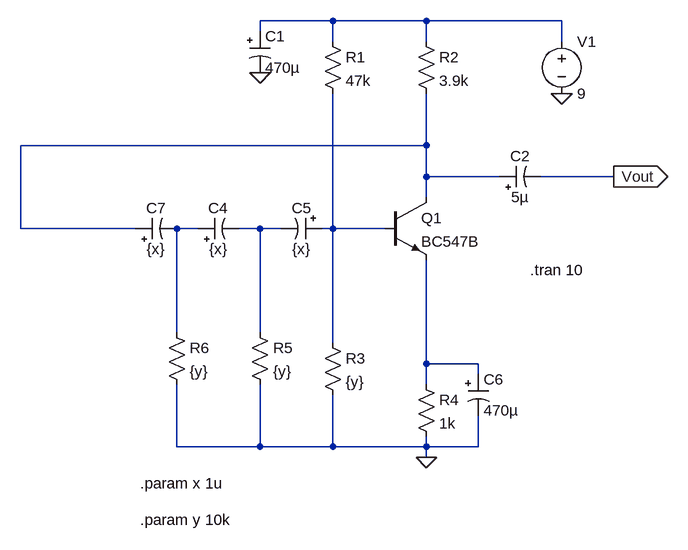
[diagram p0: schematic just_lfo.asc]
just_lfo.asc, the LTspice schematic file:
Version 4
SHEET 1 1752 768
WIRE 288 -16 176 -16
WIRE 432 -16 288 -16
WIRE 640 -16 432 -16
WIRE 176 0 176 -16
WIRE 288 16 288 -16
WIRE 432 16 432 -16
WIRE 640 16 640 -16
WIRE 432 176 -192 176
WIRE 432 176 432 96
WIRE 432 224 432 176
WIRE 544 224 432 224
WIRE 720 224 608 224
WIRE 432 256 432 224
WIRE -192 304 -192 176
WIRE -16 304 -192 304
WIRE 80 304 48 304
WIRE 176 304 144 304
WIRE 208 304 176 304
WIRE 288 304 288 96
WIRE 288 304 272 304
WIRE 368 304 288 304
WIRE 48 464 48 304
WIRE 176 464 176 304
WIRE 288 480 288 304
WIRE 432 512 432 352
WIRE 512 512 432 512
WIRE 512 528 512 512
WIRE 432 544 432 512
WIRE 48 640 48 544
WIRE 176 640 176 544
WIRE 176 640 48 640
WIRE 288 640 288 560
WIRE 288 640 176 640
WIRE 432 640 432 624
WIRE 432 640 288 640
WIRE 512 640 512 592
WIRE 512 640 432 640
WIRE 432 656 432 640
FLAG 432 656 0
FLAG 720 224 Vout
IOPIN 720 224 Out
FLAG 640 96 0
FLAG 176 64 0
SYMBOL res 272 0 R0
SYMATTR InstName R1
SYMATTR Value 47k
SYMBOL res 416 0 R0
SYMATTR InstName R2
SYMATTR Value 3.9k
SYMBOL npn 368 256 R0
SYMATTR InstName Q1
SYMATTR Value BC547B
SYMBOL res 272 464 R0
SYMATTR InstName R3
SYMATTR Value {y}
SYMBOL res 416 528 R0
SYMATTR InstName R4
SYMATTR Value 1k
SYMBOL voltage 640 0 R0
SYMATTR InstName V1
SYMATTR Value 9
SYMBOL res 160 448 R0
SYMATTR InstName R5
SYMATTR Value {y}
SYMBOL res 32 448 R0
SYMATTR InstName R6
SYMATTR Value {y}
SYMBOL polcap 160 0 R0
SYMATTR InstName C1
SYMATTR Value 470µ
SYMBOL polcap 544 240 R270
WINDOW 0 32 32 VTop 2
WINDOW 3 0 32 VBottom 2
SYMATTR InstName C2
SYMATTR Value 5µ
SYMBOL polcap 80 320 R270
WINDOW 0 32 32 VTop 2
WINDOW 3 0 32 VBottom 2
SYMATTR InstName C4
SYMATTR Value {x}
SYMBOL polcap 272 288 R90
WINDOW 0 0 32 VBottom 2
WINDOW 3 32 32 VTop 2
SYMATTR InstName C5
SYMATTR Value {x}
SYMBOL polcap 496 528 R0
SYMATTR InstName C6
SYMATTR Value 470µ
SYMBOL polcap -16 320 R270
WINDOW 0 32 32 VTop 2
WINDOW 3 0 32 VBottom 2
SYMATTR InstName C7
SYMATTR Value {x}
TEXT 592 368 Left 2 !.tran 10
TEXT -8 696 Left 2 !.param x 1u
TEXT -8 752 Left 2 !.param y 10k

The netlist it stands for:
* just_lfo.asc
R1 N001 N005 47k
R2 N001 N002 3.9k
Q1 N002 N005 N006 0 BC547B
R3 N005 0 {y}
R4 N006 0 1k
V1 N001 0 9
R5 N004 0 {y}
R6 N003 0 {y}
C1 N001 0 470µ
C2 N002 Vout 5µ
C4 N003 N004 {x}
C5 N005 N004 {x}
C6 N006 0 470µ
C7 N002 N003 {x}
.model NPN NPN
.model PNP PNP
.lib standard.bjt
.tran 10
.param x 1u
.param y 10k
.backanno
.end